# Altium schematic sheet Input_Power.SchDoc: Input Power
size A4; DrawnBy: Emre Can Damyanlı; Revision: A.1; SheetNumber: 1; SheetTotal: 4; ENG_APP_DATE: --/--/--; DSN_APP_DATE: --/--/--; CHK_APP_DATE: --/--/--
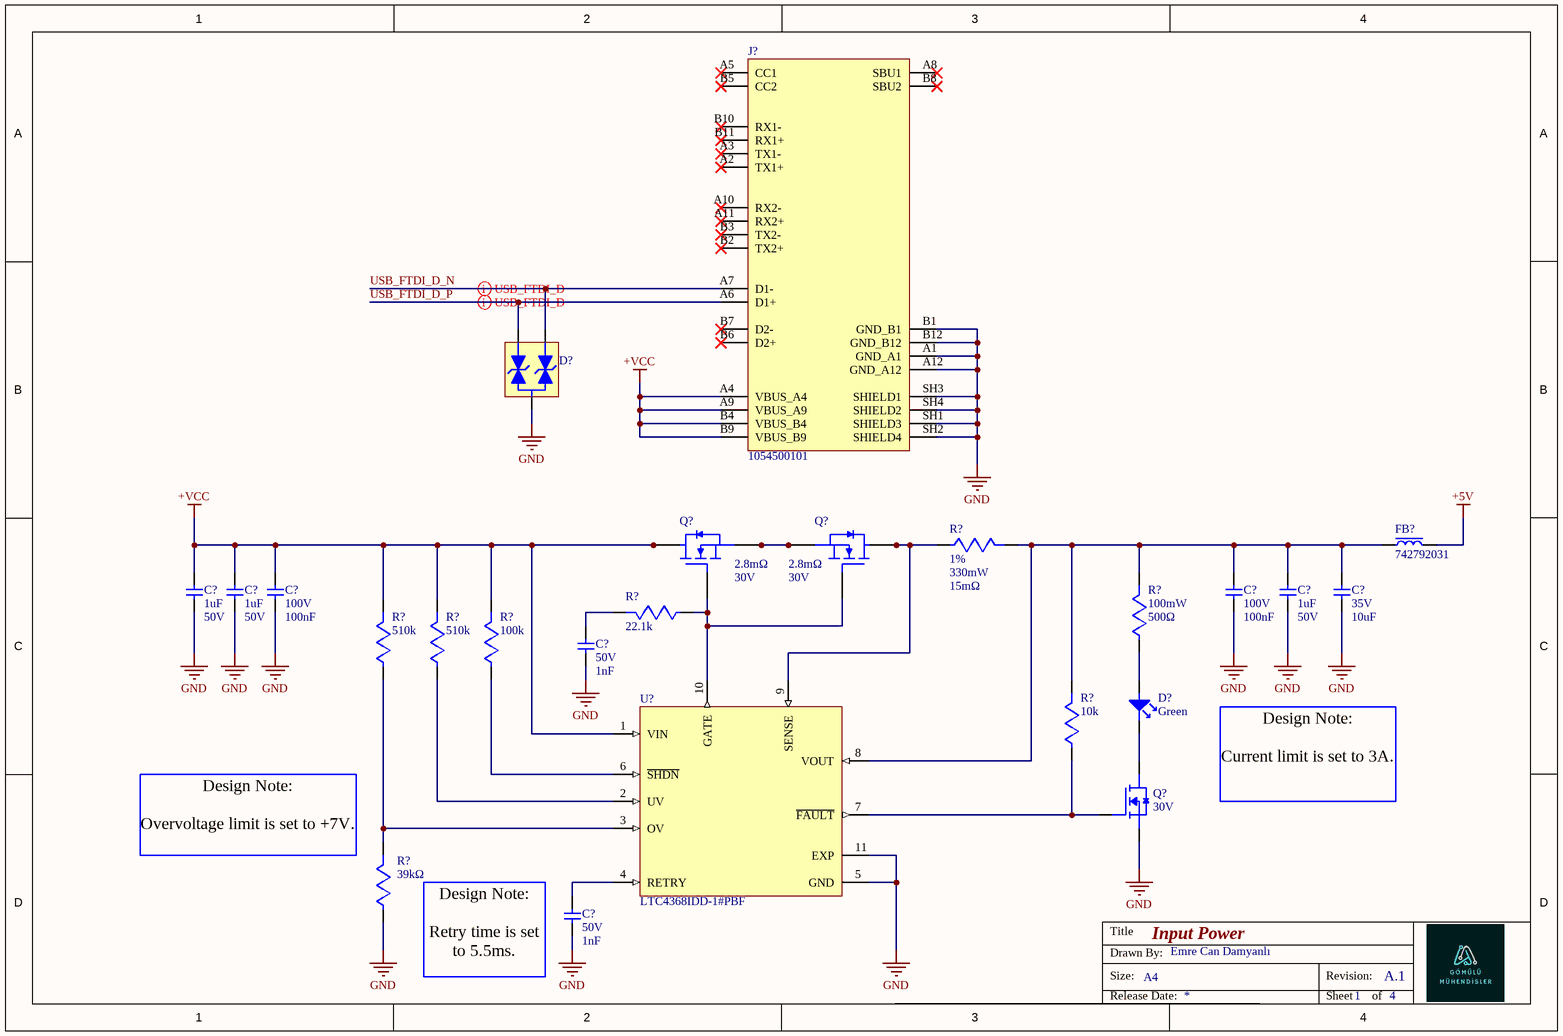
[diagram p0: Input_Power.SchDoc]

## Parts
(Parts that share a designator on the sheet are numbered #1, #2 ... from top to bottom, then left to right.)
C?#1  value 1uF  Voltage Rating: 50V  [CAPC1608X94N]  (hidden comment: 06035C105KAT2A)
C?#2  value 1uF  Voltage Rating: 50V  [CAPC1608X94N]  (hidden comment: 06035C105KAT2A)
C?#3  value 100nF  Voltage Rating: 100V  [CAPC1608X94N]  (hidden comment: GCJ188R72A104KA01D)
C?#4  value 100nF  Voltage Rating: 100V  [CAPC1608X94N]  (hidden comment: GCJ188R72A104KA01D)
C?#5  value 1uF  Voltage Rating: 50V  [CAPC1608X94N]  (hidden comment: 06035C105KAT2A)
C?#6  value 10uF  Voltage Rating: 35V  [CAPC2012X145N]  (hidden comment: C2012X5R1V106K125AC)
C?#7  value 1nF  Voltage Rating: 50V  [CAPC1608X94N]  (hidden comment: GCJ188R71H102KA01D)
C?#8  value 1nF  Voltage Rating: 50V  [CAPC1608X94N]  (hidden comment: GCJ188R71H102KA01D)
D?#1  ESDCAN02-2BWY  [SOT65P210X110-3N]  (value not drawn)
D?#2  Color: Green  [LED_0603_GREEN]  (hidden comment: LTST-C191KGKT)
FB?  742792031  [BEADC2012X105N]
J?  1054500101  [MOLEX_1054500101]
Q?#1  Rds On Max: 2.8mΩ  Drain to Source Breakdown Voltage: 30V  [SIR500DPT1RE3]  (hidden comment: SIR818DP-T1-GE3)
Q?#2  Rds On Max: 2.8mΩ  Drain to Source Breakdown Voltage: 30V  [SIR500DPT1RE3]  (hidden comment: SIR818DP-T1-GE3)
Q?#3  Drain to Source Voltage (Vdss): 30V  [CDSOT23]  (hidden comment: DMG3402L-7)
R?#1  value 15mΩ  Tolerance: 1%  Power Dissipation: 330mW  [RESISTOR_0603]  (hidden comment: WSTC0603DLR015FNR)
R?#2  value 22.1k  [RESISTOR_0603]  (hidden comment: RC0603FR-0722K1L)
R?#3  value 500Ω  Power Rating: 100mW  [RESISTOR_0603]  (hidden comment: RT0603BRC07500RL)
R?#4  value 100k  [RESISTOR_0603]  (hidden comment: RC0603FR-07100KL)
R?#5  value 510k  [RESISTOR_0603]  (hidden comment: RC0603FR-07510KL)
R?#6  value 510k  [RESISTOR_0603]  (hidden comment: RC0603FR-07510KL)
R?#7  value 10k  [RESISTOR_0603]  (hidden comment: RC0603FR-0710KL)
R?#8  value 39kΩ  [RESISTOR_0603]  (hidden comment: RC0603FR-0739KP)
U?  LTC4368IDD-1#PBF  [SON50P300X300X80-11N]

## Nets
+5V: FB?.2
+VCC: C?#1.2 C?#2.2 C?#3.2 J?.A4(VBUS_A4) J?.A9(VBUS_A9) J?.B4(VBUS_B4) J?.B9(VBUS_B9) Q?#1.1(S_1) Q?#1.2(S_2) Q?#1.3(S_3) R?#4.2 R?#5.2 R?#6.2 U?.1(VIN)
GND: C?#1.1 C?#2.1 C?#3.1 C?#4.1 C?#5.1 C?#6.1 C?#7.1 C?#8.1 D?#1.3 J?.A1(GND_A1) J?.A12(GND_A12) J?.B1(GND_B1) J?.B12(GND_B12) J?.SH1(SHIELD3) J?.SH2(SHIELD4) J?.SH3(SHIELD1) J?.SH4(SHIELD2) Q?#3.2(S) R?#8.1 U?.5(GND) U?.11(EXP)
USB_FTDI_D_N: D?#1.1 J?.A7(D1-)
USB_FTDI_D_P: D?#1.2 J?.A6(D1+)
NetC?#4_2: C?#4.2 C?#5.2 C?#6.2 FB?.1 R?#1.2 R?#3.2 R?#7.2 U?.8(VOUT)
NetC?#7_2: C?#7.2 R?#2.2
NetC?#8_2: C?#8.2 U?.4(RETRY)
NetD?#2_1: D?#2.1 R?#3.1
NetD?#2_2: D?#2.2 Q?#3.3(D)
NetQ?#1_4: Q?#1.4(G) Q?#2.4(G) R?#2.1 U?.10(GATE)
NetQ?#1_5: Q?#1.5(D_1) Q?#1.6(D_2) Q?#1.7(D_3) Q?#1.8(D_4) Q?#1.9(EP) Q?#2.5(D_1) Q?#2.6(D_2) Q?#2.7(D_3) Q?#2.8(D_4) Q?#2.9(EP)
NetQ?#2_1: Q?#2.1(S_1) Q?#2.2(S_2) Q?#2.3(S_3) R?#1.1 U?.9(SENSE)
NetQ?#3_1: Q?#3.1(G) R?#7.1 U?.7(~{FAULT})
NetR?#4_1: R?#4.1 U?.6(~{SHDN})
NetR?#5_1: R?#5.1 R?#8.2 U?.3(OV)
NetR?#6_1: R?#6.1 U?.2(UV)

Not connected (* = marked no-connect by the designer): J? A2(TX1+)* A3(TX1-)* A5(CC1)* A8(SBU1)* A10(RX2-)* A11(RX2+)* B2(TX2+)* B3(TX2-)* B5(CC2)* B6(D2+)* B7(D2-)* B8(SBU2)* B10(RX1-)* B11(RX1+)*

## Layout directives
differential pair: USB_FTDI_D_N, USB_FTDI_D_P

## Notes on the sheet
- (near R?#8) Design Note:
  Overvoltage limit is set to +7V.
- Design Note:
  Current limit is set to 3A.
- Design Note:
  Retry time is set to 5.5ms.
- Title
- Size:
- Drawn By:
- A4
- Revision:
- Release Date:
- Sheet
- of

## Library data of the parts
C?#1 C?#2 C?#5 = 06035C105KAT2A: Multilayer Ceramic Capacitor, 1 uF, 50 V, ± 10%, X7R, 0603 [1608 Metric]; Manufacturer: Kyocera AVX; Material: 4241ConductorMaterial; Dielectric: 1511DielectricType; Supplier: Digikey; Supplier Part Number: 478-10073-1-ND; Manufacturer Part Number: 06035C105KAT2A; RoHS: Yes; Category: Ceramic Capacitors; Stock: 151526; Pricing: 1=0,53, 10=0,353, 50=0,281, 100=0,232, 500=0,18128, 1000=0,15409 (USD); Mounting Technology: Surface Mount; Case/Package: 345Case; Min Operating Temperature: -55°C; Max Operating Temperature: 125°C; Series: -; Packaging: Cut Tape; Tolerance: 10%; Voltage Rating (DC): 50V; Height: 940um; RoHS Compliant: Yes; ComponentLink1URL: http://datasheet.octopart.com/06035C105KAT2A-KYOCERA-AVX-datasheet-156093842.pdf?src-supplier=Newark; ComponentLink1Description: http://datasheet.octopart.com/06035C105KAT2A-KYOCERA-AVX-datasheet-156093842.pdf?src-supplier=Newark; ComponentLink2URL: https://datasheet.octopart.com/06035C105KAT2A-KYOCERA-AVX-datasheet-156093841.pdf?src-supplier=Future+Electronics; ComponentLink2Description: https://datasheet.octopart.com/06035C105KAT2A-KYOCERA-AVX-datasheet-156093841.pdf?src-supplier=Future+Electronics; ComponentLink3URL: http://catalogs.avx.com/SurfaceMount.pdf?src-supplier=Digikey; ComponentLink3Description: http://catalogs.avx.com/SurfaceMount.pdf?src-supplier=Digikey; ComponentLink4URL: http://datasheets.avx.com/X7RDielectric.pdf?src-supplier=Digikey; ComponentLink4Description: http://datasheets.avx.com/X7RDielectric.pdf?src-supplier=Digikey; ComponentLink5URL: http://datasheet.octopart.com/06035C105KAT2A-KYOCERA-AVX-datasheet-156093842.pdf?src-supplier=Mouser; ComponentLink5Description: http://datasheet.octopart.com/06035C105KAT2A-KYOCERA-AVX-datasheet-156093842.pdf?src-supplier=Mouser; ComponentLink6URL: https://datasheet.octopart.com/06035C105KAT2A-KYOCERA-AVX-datasheet-156093842.pdf?src-supplier=TME; ComponentLink6Description: https://datasheet.octopart.com/06035C105KAT2A-KYOCERA-AVX-datasheet-156093842.pdf?src-supplier=TME; ComponentLink7URL: http://datasheet.octopart.com/06035C105KAT2A-KYOCERA-AVX-datasheet-156093842.pdf?src-supplier=TTI; ComponentLink7Description: http://datasheet.octopart.com/06035C105KAT2A-KYOCERA-AVX-datasheet-156093842.pdf?src-supplier=TTI
C?#3 C?#4 = GCJ188R72A104KA01D: Cap Ceramic 0.1uF 100V X7R 10% Pad SMD 0603 Soft Termination 125C Automotive T/R; Manufacturer: Murata; Material: 4241ConductorMaterial; Supplier: Digikey; Supplier Part Number: 490-13420-1-ND; Manufacturer Part Number: GCJ188R72A104KA01D; RoHS: Yes; Category: Ceramic Capacitors; Stock: 681954; Pricing: 1=0,19, 10=0,123, 50=0,0774, 100=0,0619, 500=0,04472, 1000=0,03956 (USD); Mounting Technology: Surface Mount; Case/Package: 0603; Case Code (Metric): 1608; Case Code (Imperial): 0603; Min Operating Temperature: -55°C; Max Operating Temperature: 125°C; Packaging: Cut Tape; Tolerance: 10%; Features: Soft Termination; Series: GCJ; Length: 0.063inch; Width: 0.031inch; Height: 900um; Thickness: 0.035inch; Ratings: AEC-Q200; RoHS Compliant: Yes; Lead Free: 5697LeadFree; ComponentLink1URL: https://datasheet.octopart.com/GCJ188R72A104KA01D-Murata-datasheet-78375067.pdf?src-supplier=Future+Electronics; ComponentLink1Description: https://datasheet.octopart.com/GCJ188R72A104KA01D-Murata-datasheet-78375067.pdf?src-supplier=Future+Electronics; ComponentLink2URL: http://search.murata.co.jp/Ceramy/image/img/A01X/partnumbering_e_02.pdf?src-supplier=Digikey; ComponentLink2Description: http://search.murata.co.jp/Ceramy/image/img/A01X/partnumbering_e_02.pdf?src-supplier=Digikey; ComponentLink3URL: https://www.murata.com/~/media/webrenewal/support/library/catalog/products/capacitor/mlcc/c03e.ashx?la=en-us&src-supplier=Digikey; ComponentLink3Description: https://www.murata.com/~/media/webrenewal/support/library/catalog/products/capacitor/mlcc/c03e.ashx?la=en-us&src-supplier=Digikey; ComponentLink4URL: https://datasheet.octopart.com/GCJ188R72A104KA01D-Murata-datasheet-165611796.pdf?src-supplier=TME; ComponentLink4Description: https://datasheet.octopart.com/GCJ188R72A104KA01D-Murata-datasheet-165611796.pdf?src-supplier=TME
C?#6 = C2012X5R1V106K125AC: Cap Ceramic 10uF 35V X5R 10% SMD 0805 85°C Blister Plastic T/R; Manufacturer: TDK; Supplier: Digi-Key; Supplier Part Number: 445-14418-1-ND; Manufacturer Part Number: C2012X5R1V106K125AC; RoHS: Yes; Category: Ceramic Capacitors; Stock: 387097; Pricing: 1=0,63, 10=0,42, 50=0,3342, 100=0,276, 500=0,2156, 1000=0,18326 (USD); Mounting Technology: Surface Mount; Case/Package: 0805; Case Code (Metric): 2012; Case Code (Imperial): 0805; Weight: 0.000194oz; Dielectric Material: Ceramic; Min Operating Temperature: -55°C; Max Operating Temperature: 85°C; Package Quantity: 2000; Packaging: Tape and Reel; Tolerance: 10%; Dielectric: X5R; Termination: SMD/SMT; Voltage Rating (DC): 35V; Series: C; Length: 2mm; Width: 1.25mm; Height: 1.25mm; Reach SVHC Compliant: No; Lead Free: Lead Free; RoHS Compliant: Yes; ComponentLink1URL: https://datasheet.ciiva.com/14886/tdkmlcccaprange-14886603.pdf?src-supplier=Digi-Key; ComponentLink1Description: https://datasheet.ciiva.com/14886/tdkmlcccaprange-14886603.pdf?src-supplier=Digi-Key; ComponentLink2URL: https://datasheet.ciiva.com/14886/tdkmlcccaprange-14886602.pdf?src-supplier=Digi-Key; ComponentLink2Description: https://datasheet.ciiva.com/14886/tdkmlcccaprange-14886602.pdf?src-supplier=Digi-Key; ComponentLink3URL: https://datasheet.ciiva.com/14886/tdkmlcccaprange-14886604.pdf?src-supplier=Digi-Key; ComponentLink3Description: https://datasheet.ciiva.com/14886/tdkmlcccaprange-14886604.pdf?src-supplier=Digi-Key
C?#7 C?#8 = GCJ188R71H102KA01D: Multilayer Ceramic Capacitor, 1000 pF, 50 V, ± 10%, X7R, 0603 [1608 Metric]; Manufacturer: Murata; Material: 4241ConductorMaterial; Supplier: Digikey; Supplier Part Number: 490-5768-1-ND; Manufacturer Part Number: GCJ188R71H102KA01D; RoHS: Yes; Category: Ceramic Capacitors; Stock: 165908; Pricing: 1=0,17, 10=0,098, 50=0,0686, 100=0,0595, 500=0,04414, 1000=0,03936 (USD); Mounting Technology: Surface Mount; Case/Package: 0603; Case Code (Metric): 1608; Case Code (Imperial): 0603; Min Operating Temperature: -55°C; Max Operating Temperature: 125°C; Package Quantity: 1; Tolerance: 10%; Packaging: Tape and Reel; Dielectric: X7R; Voltage Rating (DC): 50V; Termination: SMD/SMT; Features: Soft Termination; Series: GCJ; Length: 0.063inch; Width: 0.031inch; Thickness: 0.031inch; Ratings: AEC-Q200; RoHS Compliant: Yes; ComponentLink1URL: https://datasheet.ciiva.com/134/product-134545.pdf?src-supplier=Digikey; ComponentLink1Description: https://datasheet.ciiva.com/134/product-134545.pdf?src-supplier=Digikey; ComponentLink2URL: https://datasheet.ciiva.com/134/s0717e-134546.pdf?src-supplier=Digikey; ComponentLink2Description: https://datasheet.ciiva.com/134/s0717e-134546.pdf?src-supplier=Digikey; ComponentLink3URL: https://datasheet.ciiva.com/134/s0717e-134547.pdf?src-supplier=Digikey; ComponentLink3Description: https://datasheet.ciiva.com/134/s0717e-134547.pdf?src-supplier=Digikey
D?#1 = ESDCAN02-2BWY: Trans Voltage Suppressor Diode, 250W, 26.5V V(RWM), Bidirectional, 2 Element, Silicon; Manufacturer: STMicroelectronics; Package Body Material: Plastic; Max Breakdown Voltage: 31.7V; Min Breakdown Voltage: 28.5V; Number of Elements: 2; Reference Standard: AEC-Q101; Supplier 1: Digikey; Manufacturer Part Number: ESDCAN02-2BWY; RoHS: Yes; Category: TVS Diodes; Stock 1: 18415; Pricing 1: 1=0.4, 10=0.309, 100=0.1854, 500=0.1717, 1000=0.11676 (USD); Pins: 3; Diode Element Material: SILICON; Package Shape: Rectangular; Min Operating Temperature: -55°C; Max Operating Temperature: 175°C; Polarity: Bidirectional; Diode Type: TRANS VOLTAGE SUPPRESSOR; JESD-30 Code: R-PDSO-G3; Non-rep Peak Rev Power Dis-Max: 250W; Package Style: SMALL OUTLINEMeter; Rep Pk Reverse Voltage-Max: 26.5V; Surface Mount: Yes; Technology: AVALANCHE; Terminal Form: Gull Wing; Terminal Position: DUAL; Reach SVHC Compliant: Yes; RoHS Compliant: Yes; ComponentLink1URL: https://datasheet.ciiva.com:443/pdfs/VipMasterIC/IC/SGST/SGST-S-A0006719210/SGST-S-A0006719210-1.pdf?src-supplier=IHS+Markit; ComponentLink1Description: https://datasheet.ciiva.com:443/pdfs/VipMasterIC/IC/SGST/SGST-S-A0006719210/SGST-S-A0006719210-1.pdf?src-supplier=IHS+Markit; ComponentLink2URL: http://www.mouser.com/ds/2/389/esdcan02-2bwy-954689.pdf?src-supplier=Mouser; ComponentLink2Description: http://www.mouser.com/ds/2/389/esdcan02-2bwy-954689.pdf?src-supplier=Mouser; ComponentLink3URL: https://www.st.com/resource/en/datasheet/esdcan06-2bwy.pdf?src-supplier=Digikey; ComponentLink3Description: https://www.st.com/resource/en/datasheet/esdcan06-2bwy.pdf?src-supplier=Digikey; Supplier Part Number 1: 497-15845-1-ND
D?#2 = LTST-C191KGKT: LTST-C191KGKT Lite-On LED, green, 18-71mcd, 130, 1.9V-2.4V SMD, 0603 1.6x0.8x0.55mm RoHS; Manufacturer: Vishay Lite-On; Lens Color: Colorless; Luminous Intensity: 35mcd; Viewing Angle: 130°; Lens Style: Flat,Rectangular,Colorless; Forward Voltage: 2V; Dominant Wavelength: 571nm; Test Current: 20mA; Lens Transparency: Clear; Wavelength: 574nm; Number of LEDs: 1; Max Power Dissipation: 75mW; Lens Size: 0.8mm; Supplier: Digi-Key; Supplier Part Number: 160-1446-1-ND; Manufacturer Part Number: LTST-C191KGKT; RoHS: Yes; Stock: 1655174; Pricing: 1=0,25, 10=0,136, 100=0,063, 500=0,05818, 1000=0,04557, 2000=0,0446 (USD); Mounting Technology: Surface Mount; Case/Package: 0603; Pins: 2; Case Code (Metric): 1608; Case Code (Imperial): 0603; Min Operating Temperature: -55°C; Max Operating Temperature: 85°C; Packaging: Tape and Reel; Series: -; Length: 1.6mm; Width: 0.8mm; Height: 0.65mm; RoHS Compliant: Yes; Lead Free: Lead Free; ComponentLink1URL: https://datasheet.ciiva.com/2109/ltst-c191kgkt-2109973.pdf?src-supplier=Digi-Key; ComponentLink1Description: https://datasheet.ciiva.com/2109/ltst-c191kgkt-2109973.pdf?src-supplier=Digi-Key
FB? = 742792031: WE-CBF Ferrite Bead 0805 300Ohm 3000mA; Manufacturer: Wurth Electronics; Value: 0.36H; Tolerance: 25%; Current Rating: 3A; Impedance: 300R; Number of Lines: 1; DC Resistance (DCR): 50mR; Test Frequency: 200MHz; Supplier: Digi-Key; Supplier Part Number: 732-4638-1-ND; Manufacturer Part Number: 742792031; RoHS: Yes; Category: Ferrite Beads and Chips; Stock: 305302; Pricing: 1=0,23, 50=0,224, 100=0,206, 500=0,197, 1000=0,187, 2000=0,179 (USD); Mounting Technology: Surface Mount; Case/Package: SMD/SMT; Core Material: Ferrite; Case Code (Metric): 2012; Case Code (Imperial): 0805; Weight: 0.000194oz; Material: Ferrite; Min Operating Temperature: -55°C; Max Operating Temperature: 125°C; Package Quantity: 1; Packaging: Tape and Reel; Max Current Rating: 3A; Max DC Current: 3A; Termination: SMD/SMT; Series: WE-CBF; Length: 2mm; Width: 1.2mm; Height: 0.9mm; Depth: 1.2mm; RoHS Compliant: Yes; Reach SVHC Compliant: Unknown; ComponentLink1URL: https://datasheet.ciiva.com/1126/1468425-1126563.pdf?src-supplier=Element14; ComponentLink1Description: https://datasheet.ciiva.com/1126/1468425-1126563.pdf?src-supplier=Element14; ComponentLink2URL: https://datasheet.ciiva.com/11799/0900766b80d2dd7c-11799762.pdf?src-supplier=Rs; ComponentLink2Description: https://datasheet.ciiva.com/11799/0900766b80d2dd7c-11799762.pdf?src-supplier=Rs; ComponentLink3URL: https://datasheet.ciiva.com/29364/742792031-29364444.pdf?src-supplier=Digi-Key; ComponentLink3Description: https://datasheet.ciiva.com/29364/742792031-29364444.pdf?src-supplier=Digi-Key; ComponentLink4URL: https://datasheet.ciiva.com/14122/742792031-eng-tds-14122797.pdf?src-supplier=Distrelec; ComponentLink4Description: https://datasheet.ciiva.com/14122/742792031-eng-tds-14122797.pdf?src-supplier=Distrelec; ComponentLink5URL: https://datasheet.ciiva.com/48698/001086958-da-01-ml-we-cbf-smd-ferrit-742792031-de-en-48698519.pdf?src-supplier=Conrad; ComponentLink5Description: https://datasheet.ciiva.com/48698/001086958-da-01-ml-we-cbf-smd-ferrit-742792031-de-en-48698519.pdf?src-supplier=Conrad
J? = 105450-0101: USB Connector, 24 Contact(s), Female, Right Angle, Surface Mount Terminal, Receptacle; Manufacturer: Molex; Plating: 157ConductorMaterial; Number of Contacts: 24; Number of Ports: 1; USB Standard: USB 3.1; Mating Cycles: 10000; Shielding: Shielded; Number of Circuits: 24NUMBER; Voltage Rating: 30V; Pitch: 0.5mm; Supplier: Digi-Key; Supplier Part Number: WM12856CT-ND; Manufacturer Part Number: 105450-0101; RoHS: Yes; Category: USB Connectors; Stock: 54929; Pricing: 1=2,68, 10=2,283, 100=1,886 (USD); Mounting Technology: Surface Mount,Horizontal,Through Hole; Case/Package: 0101; Pins: 24; Contact Material: Copper Alloy; Contact Plating: Gold; Housing Material: Thermoplastic; Insulation Color: Black; Min Operating Temperature: -30°C; Max Operating Temperature: 85°C; Packaging: Tape and Reel; Connector Type: USB; Gender: Receptacle; Orientation: Right Angle; Termination: Solder; Features: Shielded; Series: -; Number of Rows: 2NUMBER; Length: 8.94mm; Height: 3.44mm; Flammability Rating: UL94 V-0; RoHS Compliant: Yes; Reach SVHC Compliant: Unknown; ComponentLink1URL: http://www.farnell.com/datasheets/2801634.pdf?src-supplier=Farnell; ComponentLink1Description: http://www.farnell.com/datasheets/2801634.pdf?src-supplier=Farnell; ComponentLink2URL: http://www.farnell.com/datasheets/2801634.pdf?src-supplier=Newark; ComponentLink2Description: http://www.farnell.com/datasheets/2801634.pdf?src-supplier=Newark; ComponentLink3URL: http://www.literature.molex.com/SQLImages/kelmscott/Molex/PDF_Images/987651-4081.PDF?src-supplier=Avnet; ComponentLink3Description: http://www.literature.molex.com/SQLImages/kelmscott/Molex/PDF_Images/987651-4081.PDF?src-supplier=Avnet; ComponentLink4URL: http://www.farnell.com/datasheets/2015275.pdf?src-supplier=Element14; ComponentLink4Description: http://www.farnell.com/datasheets/2015275.pdf?src-supplier=Element14; ComponentLink5URL: http://www.farnell.com/datasheets/2801634.pdf?src-supplier=Element14; ComponentLink5Description: http://www.farnell.com/datasheets/2801634.pdf?src-supplier=Element14; ComponentLink6URL: http://www.farnell.com/datasheets/2672741.pdf?src-supplier=Newark; ComponentLink6Description: http://www.farnell.com/datasheets/2672741.pdf?src-supplier=Newark; ComponentLink7URL: https://www.molex.com/pdm_docs/sd/1054500101_sd.pdf?src-supplier=Digi-Key; ComponentLink7Description: https://www.molex.com/pdm_docs/sd/1054500101_sd.pdf?src-supplier=Digi-Key; ComponentLink8URL: https://www.molex.com/pdm_docs/ps/PS-105448-001.pdf?src-supplier=Digi-Key; ComponentLink8Description: https://www.molex.com/pdm_docs/ps/PS-105448-001.pdf?src-supplier=Digi-Key; ComponentLink9URL: https://datasheet.octopart.com/1054500101-Molex-datasheet-168215564.pdf?src-supplier=TME; ComponentLink9Description: https://datasheet.octopart.com/1054500101-Molex-datasheet-168215564.pdf?src-supplier=TME
Q?#1 Q?#2 = SIR818DP-T1-GE3: Single N-Channel 30 V 0.0028 Ohm 69 W Surface Mount Power Mosfet - PowerPAK-SO-8; Manufacturer: Vishay; Continuous Drain Current (ID): 50A; Drain to Source Resistance: 3.3mΩ; Fall Time: 10ns; Gate to Source Voltage (Vgs): 20V; Input Capacitance: 3.66nF; Max Power Dissipation: 69W; Number of Channels: 1; Power Dissipation: 5.2W; Value: 2.8mΩ; Rise Time: 15ns; Turn-Off Delay Time: 36ns; Turn-On Delay Time: 14ns; Supplier: Arrow Electronics; Supplier Part Number: SIR818DP-T1-GE3; Manufacturer Part Number: SIR818DP-T1-GE3; RoHS: Compliant; Category: MOSFETs; Stock: 3000; Pricing: 3000=0,4523 (USD); Drain to Source Voltage (Vdss): 30V; Element Configuration: Single; Lead Free: Lead Free; Lifecycle Status: NRND; Max Operating Temperature: 150°C; Min Breakdown Voltage: 30V; Min Operating Temperature: -55°C; Mounting Technology: Surface Mount; Number of Elements: 1; Pins: 8; Number of Terminals: 5; Radiation Hardening: No; REACH SVHC: Yes; Schedule B: 8541290080, 8541290080|8541290080|8541290080|8541290080|8541290080; Weight: 506.605978mg; ComponentLink1URL: https://datasheet.octopart.com:443/SIR818DP-T1-GE3-Vishay-datasheet-181474050.pdf?src-supplier=IHS; ComponentLink1Description: https://datasheet.octopart.com:443/SIR818DP-T1-GE3-Vishay-datasheet-181474050.pdf?src-supplier=IHS; ComponentLink2URL: https://datasheet.octopart.com:443/SIR818DP-T1-GE3-Vishay-datasheet-12524466.pdf?src-supplier=Future+Electronics; ComponentLink2Description: https://datasheet.octopart.com:443/SIR818DP-T1-GE3-Vishay-datasheet-12524466.pdf?src-supplier=Future+Electronics; ComponentLink3URL: http://sigma.octopart.com:80/rohs_statement/Vishay-company-15.pdf?src-supplier=Compliance+Statements; ComponentLink3Description: http://sigma.octopart.com:80/rohs_statement/Vishay-company-15.pdf?src-supplier=Compliance+Statements
Q?#3 = DMG3402L-7: MOSFET N-CH 30V 4A SOT23; Manufacturer: Diodes; Rds On Max: 52mR; Input Capacitance: 464pF; Rise Time: 1.6ns; Max Power Dissipation: 1.4W; Fall Time: 2ns; Turn-Off Delay Time: 10.3ns; Turn-On Delay Time: 1.9ns; Gate to Source Voltage (Vgs): 12V; Number of Channels: 1; Polarity: N-CHANNEL; Supplier: Digi-Key; Supplier Part Number: DMG3402L-7DICT-ND; Manufacturer Part Number: DMG3402L-7; RoHS: Yes; Category: MOSFETs; Stock: 1011067; Pricing: 1=0,42, 10=0,298, 100=0,1503, 500=0,13316, 1000=0,10363 (USD); Mounting Technology: Surface Mount; Case/Package: SOT-23; Pins: 3; Weight: 0.000282oz; Min Operating Temperature: -55°C; Max Operating Temperature: 150°C; Package Quantity: 3000; Packaging: Tape and Reel; Continuous Drain Current (ID): 4A; Drain to Source Resistance: 52mR; Series: -; RoHS Compliant: Yes; Lead Free: Lead Free; ComponentLink1URL: http://www.mouser.com/ds/2/115/DMG3402L-473526.pdf?src-supplier=Mouser; ComponentLink1Description: http://www.mouser.com/ds/2/115/DMG3402L-473526.pdf?src-supplier=Mouser; ComponentLink2URL: http://diodes.com/datasheets/DMG3402L.pdf?src-supplier=Avnet; ComponentLink2Description: http://diodes.com/datasheets/DMG3402L.pdf?src-supplier=Avnet
R?#1 = WSTC0603DLR015FNR: Fixed Resistor, Metal Foil, 0.33W, 0.015ohm, 1% +/-Tol, 75ppm/Cel, Surface Mount, 0603; Manufacturer: Littelfuse; Temperature Coefficient: 75ppm/°C; Supplier: Mouser; Supplier Part Number: 576-WSTC0603DLR015FN; Manufacturer Part Number: WSTC0603DLR015FNR; RoHS: Compliant; Category: Chip SMD Resistors; Stock: 4890; Pricing: 1=0,46, 10=0,293, 50=0,221, 100=0,197, 1000=0,14, 10000=0,104 (USD); Height: 350µm; Lifecycle Status: Production; Max Operating Temperature: 155°C; Min Operating Temperature: -55°C; Mounting Technology: Surface Mount; Number of Terminals: 2; Width: 800µm; ComponentLink1URL: https://datasheet.octopart.com:443/WSTC0603DLR015FNR-Littelfuse-datasheet-182144291.pdf?src-supplier=IHS; ComponentLink1Description: https://datasheet.octopart.com:443/WSTC0603DLR015FNR-Littelfuse-datasheet-182144291.pdf?src-supplier=IHS
R?#2 = RC0603FR-0722K1L: SMD Chip Resistor, 22.1 kOhm, ± 1%, 100 mW, 0603 [1608 Metric], Thick Film, General Purpose; Manufacturer: Yageo; Power Rating: 100mW; Voltage Rating: 50V; Temperature Coefficient: 100ppm/°C; Supplier: Digikey; Supplier Part Number: 311-22.1KHRCT-ND; Manufacturer Part Number: RC0603FR-0722K1L; RoHS: Yes; Category: Chip SMD Resistors; Stock: 232210; Pricing: 1=0,1, 10=0,019, 50=0,0112, 100=0,0093, 500=0,00622, 1000=0,00532 (USD); Case/Package: 0603; Case Code (Imperial): 0603; Case Code (Metric): 1608; Min Operating Temperature: -55°C; Max Operating Temperature: 155°C; Tolerance: 1%; Package Quantity: 5000; Packaging: Tape and Reel; Termination: SMD/SMT; Series: RC; Features: Moisture Resistant; Max Power Dissipation: 100mW; Number of Terminations: 2; Voltage Rating (DC): 50V; Length: 1.6mm; Width: 0.8mm; Height: 0.45mm; RoHS Compliant: Yes; Lead Free: 5697LeadFree; ComponentLink1URL: https://datasheet.ciiva.com/12555/rc0603-272842-12555287.pdf?src-supplier=Mouser; ComponentLink1Description: https://datasheet.ciiva.com/12555/rc0603-272842-12555287.pdf?src-supplier=Mouser
R?#3 = RT0603BRC07500RL: Fixed Resistor, Thin Film, 0.1W, 500ohm, 75V, 0.1% +/-Tol, 15ppm/Cel, Surface Mount, 0603; Manufacturer: Yageo Group; Temperature Coefficient: 15ppm/°C; Supplier: Farnell; Supplier Part Number: 4152629; Manufacturer Part Number: RT0603BRC07500RL; RoHS: Compliant; Category: Chip SMD Resistors; Stock: 4870; Pricing: 5000=0,12 (EUR); Case/Package: 0603; China RoHS: Non-Compliant; Composition: Thin Film; Height: 450µm; Lifecycle Status: Production; Max Operating Temperature: 155°C; Min Operating Temperature: -55°C; Mounting Technology: Surface Mount; Number of Terminals: 2; Packaging: Tape & Reel; Power Dissipation: 100mW; REACH SVHC: Yes; Tolerance: 0.1%; Voltage Rating: 75V; Width: 800µm; Working Voltage: 75V; ComponentLink1URL: https://datasheet.octopart.com:443/RT0603BRC07500RL-Yageo-datasheet-176402239.pdf?src-supplier=IHS; ComponentLink1Description: https://datasheet.octopart.com:443/RT0603BRC07500RL-Yageo-datasheet-176402239.pdf?src-supplier=IHS; ComponentLink2URL: https://datasheet.octopart.com:443/RT0603BRC07500RL-Yageo-datasheet-141265893.pdf?src-supplier=ODG+(Origin+Data+Global); ComponentLink2Description: https://datasheet.octopart.com:443/RT0603BRC07500RL-Yageo-datasheet-141265893.pdf?src-supplier=ODG+(Origin+Data+Global); ComponentLink3URL: https://datasheet.octopart.com:443/RT0603BRC07500RL-Yageo-datasheet-169971040.pdf?src-supplier=Upverter; ComponentLink3Description: https://datasheet.octopart.com:443/RT0603BRC07500RL-Yageo-datasheet-169971040.pdf?src-supplier=Upverter; ComponentLink4URL: https://datasheet.octopart.com:443/RT0603BRC07500RL-Yageo-datasheet-166250672.pdf?src-supplier=Future+Electronics; ComponentLink4Description: https://datasheet.octopart.com:443/RT0603BRC07500RL-Yageo-datasheet-166250672.pdf?src-supplier=Future+Electronics; ComponentLink5URL: https://datasheet.octopart.com/RT0603BRC07500RL-Yageo-datasheet-86813807.pdf; ComponentLink5Description: https://datasheet.octopart.com/RT0603BRC07500RL-Yageo-datasheet-86813807.pdf; ComponentLink6URL: http://sigma.octopart.com:80/rohs_statement/Yageo-company-2.pdf?src-supplier=Compliance+Statements; ComponentLink6Description: http://sigma.octopart.com:80/rohs_statement/Yageo-company-2.pdf?src-supplier=Compliance+Statements; ComponentLink7URL: http://sigma.octopart.com:80/conflict_mineral_statement/Yageo-company-3.pdf?src-supplier=Compliance+Statements; ComponentLink7Description: http://sigma.octopart.com:80/conflict_mineral_statement/Yageo-company-3.pdf?src-supplier=Compliance+Statements
R?#4 = RC0603FR-07100KL: SMD Chip Resistor, 100 kOhm, ± 1%, 100 mW, 0603 [1608 Metric], Thick Film, General Purpose; Manufacturer: Yageo; Temperature Coefficient: 100ppm/°C; Voltage Rating (DC): 50V; Power Rating: 100mW; Supplier: Digi-Key; Supplier Part Number: 311-100KHRCT-ND; Manufacturer Part Number: RC0603FR-07100KL; RoHS: Yes; Category: Chip SMD Resistors; Stock: 3229176; Pricing: 1=0,1, 10=0,018, 50=0,0106, 100=0,0088, 500=0,00592, 1000=0,00505 (USD); Case/Package: 0603; Pins: 2; Case Code (Imperial): 0603; Case Code (Metric): 1608; Min Operating Temperature: -55°C; Max Operating Temperature: 155°C; Tolerance: 1%; Resistor Type: Thick Film; Packaging: Tape and Reel; Voltage Rating: 50V; Termination: SMD/SMT; Number of Terminations: 2; Features: Moisture Resistant; Series: RC; Max Power Dissipation: 100mW; Resistance Tolerance: 1%; Construction: Rectangular; Technology: THICK FILM; Length: 1.6mm; Width: 0.8mm; Height: 0.45mm; Depth: 0.8mm; Reach SVHC Compliant: No; Military Standard: Not; RoHS Compliant: Yes
R?#5 R?#6 = RC0603FR-07510KL: SMD Chip Resistor, 510 kOhm, ± 1%, 100 mW, 0603 [1608 Metric], Thick Film, General Purpose; Manufacturer: Yageo; Supplier: Digikey; Supplier Part Number: 311-510KHRCT-ND; Manufacturer Part Number: RC0603FR-07510KL; RoHS: Yes; Category: Chip SMD Resistors; Stock: 13204; Pricing: 1=0,1, 10=0,019, 50=0,0112, 100=0,0093, 500=0,00622, 1000=0,00532 (USD); ComponentLink1URL: https://datasheet.ciiva.com/2454/pyu-r-int-thick-7-2454984.pdf?src-supplier=Digikey; ComponentLink1Description: https://datasheet.ciiva.com/2454/pyu-r-int-thick-7-2454984.pdf?src-supplier=Digikey; ComponentLink2URL: https://datasheet.ciiva.com/2454/pyu-r-int-thick-7-2454985.pdf?src-supplier=Digikey; ComponentLink2Description: https://datasheet.ciiva.com/2454/pyu-r-int-thick-7-2454985.pdf?src-supplier=Digikey; ComponentLink3URL: https://datasheet.ciiva.com/2454/pyu-r-int-thick-7-2454986.pdf?src-supplier=Digikey; ComponentLink3Description: https://datasheet.ciiva.com/2454/pyu-r-int-thick-7-2454986.pdf?src-supplier=Digikey; ComponentLink4URL: https://datasheet.ciiva.com/12555/rc0603-272842-12555383.pdf?src-supplier=Mouser; ComponentLink4Description: https://datasheet.ciiva.com/12555/rc0603-272842-12555383.pdf?src-supplier=Mouser
R?#7 = RC0603FR-0710KL: SMD Chip Resistor, 10 kOhm, ± 1%, 100 mW, 0603 [1608 Metric], Thick Film, General Purpose; Manufacturer: Yageo; Voltage Rating (DC): 50V; Temperature Coefficient: 100ppm/°C; Power Rating: 100mW; Voltage Rating: 75V; Supplier: Digi-Key; Supplier Part Number: 311-10.0KHRCT-ND; Manufacturer Part Number: RC0603FR-0710KL; RoHS: Yes; Category: Chip SMD Resistors; Stock: 19409735; Pricing: 1=0,1, 10=0,018, 50=0,0106, 100=0,0088, 500=0,00592, 1000=0,00505 (USD); Case/Package: 0603; Pins: 2; Case Code (Imperial): 0603; Case Code (Metric): 1608; Weight: 7.1E-05oz; Min Operating Temperature: -55°C; Max Operating Temperature: 155°C; Tolerance: 1%; Resistor Type: Thick Film; Packaging: Tape and Reel; Termination: SMD/SMT; Features: Moisture Resistant; Series: RC; Max Power Dissipation: 100mW; Number of Terminations: 2; Resistance Tolerance: 1%; Construction: Rectangular; Length: 1.6mm; Width: 0.8mm; Height: 0.45mm; Depth: 0.8mm; Lead Pitch: 0.3mm; Reach SVHC Compliant: No; Lead Free: 5697LeadFree; Military Standard: Not; RoHS Compliant: Yes; ComponentLink1URL: https://datasheet.ciiva.com/7660/38590-7660789.pdf?src-supplier=Element14; ComponentLink1Description: https://datasheet.ciiva.com/7660/38590-7660789.pdf?src-supplier=Element14; ComponentLink2URL: https://datasheet.ciiva.com/7983/443971-7983596.pdf?src-supplier=Element14; ComponentLink2Description: https://datasheet.ciiva.com/7983/443971-7983596.pdf?src-supplier=Element14; ComponentLink3URL: https://datasheet.ciiva.com/22747/443971-22747519.pdf?src-supplier=Element14; ComponentLink3Description: https://datasheet.ciiva.com/22747/443971-22747519.pdf?src-supplier=Element14; ComponentLink4URL: https://datasheet.ciiva.com/46440/1868787-46440891.pdf?src-supplier=Element14; ComponentLink4Description: https://datasheet.ciiva.com/46440/1868787-46440891.pdf?src-supplier=Element14; ComponentLink5URL: https://datasheet.ciiva.com/7746/1738695-7746239.pdf?src-supplier=Element14; ComponentLink5Description: https://datasheet.ciiva.com/7746/1738695-7746239.pdf?src-supplier=Element14; ComponentLink6URL: https://datasheet.ciiva.com/15189/getdatasheetpartid-409289-15189591.pdf?src-supplier=Verical; ComponentLink6Description: https://datasheet.ciiva.com/15189/getdatasheetpartid-409289-15189591.pdf?src-supplier=Verical
R?#8 = RC0603FR-0739KP: Res, 39Kohm, 1%, 0.1W, Thick Film, Smd Rohs Compliant: Yes |Yageo RC0603FR-0739KP; Manufacturer: Yageo Group; Power Dissipation: 100mW; Temperature Coefficient: 100ppm/°C; Working Voltage: 75V; Supplier: Farnell; Supplier Part Number: 3993443; Manufacturer Part Number: RC0603FR-0739KP; RoHS: Compliant; Category: Chip SMD Resistors; Stock: 4450; Pricing: 10=0,0153, 100=0,0086, 500=0,0082, 1000=0,0077, 2500=0,0067, 5000=0,0057 (EUR); China RoHS: Compliant; Height: 450µm; Lifecycle Status: Production; Max Operating Temperature: 155°C; Min Operating Temperature: -55°C; Mounting Technology: Surface Mount; Number of Terminals: 2; REACH SVHC: Yes; Tolerance: 1%; Width: 800µm; ComponentLink1URL: https://datasheet.octopart.com:443/RC0603FR-0739KP-Yageo-datasheet-182189537.pdf?src-supplier=IHS; ComponentLink1Description: https://datasheet.octopart.com:443/RC0603FR-0739KP-Yageo-datasheet-182189537.pdf?src-supplier=IHS; ComponentLink2URL: https://datasheet.octopart.com:443/RC0603FR-0739KP-Yageo-datasheet-176147777.pdf?src-supplier=Farnell; ComponentLink2Description: https://datasheet.octopart.com:443/RC0603FR-0739KP-Yageo-datasheet-176147777.pdf?src-supplier=Farnell; ComponentLink3URL: http://sigma.octopart.com:80/rohs_statement/Yageo-company-2.pdf?src-supplier=Compliance+Statements; ComponentLink3Description: http://sigma.octopart.com:80/rohs_statement/Yageo-company-2.pdf?src-supplier=Compliance+Statements; ComponentLink4URL: http://sigma.octopart.com:80/conflict_mineral_statement/Yageo-company-3.pdf?src-supplier=Compliance+Statements; ComponentLink4Description: http://sigma.octopart.com:80/conflict_mineral_statement/Yageo-company-3.pdf?src-supplier=Compliance+Statements
U? = LTC4368IDD-1#PBF: 100V UV/OV and Reverse Protection Controller with Bidirectional Circuit Breaker; MF: Analog Devices; SnapEDA_Link: https://www.snapeda.com/parts/LTC4368IDD-1%23PBF/Analog+Devices/view-part/?ref=snap; Package: DFN -10 Analog Devices; Value: *; MP: LTC4368IDD-1#PBF; Check_prices: https://www.snapeda.com/parts/LTC4368IDD-1%23PBF/Analog+Devices/view-part/?ref=eda